# Altium project AltInterface.PrjPcb
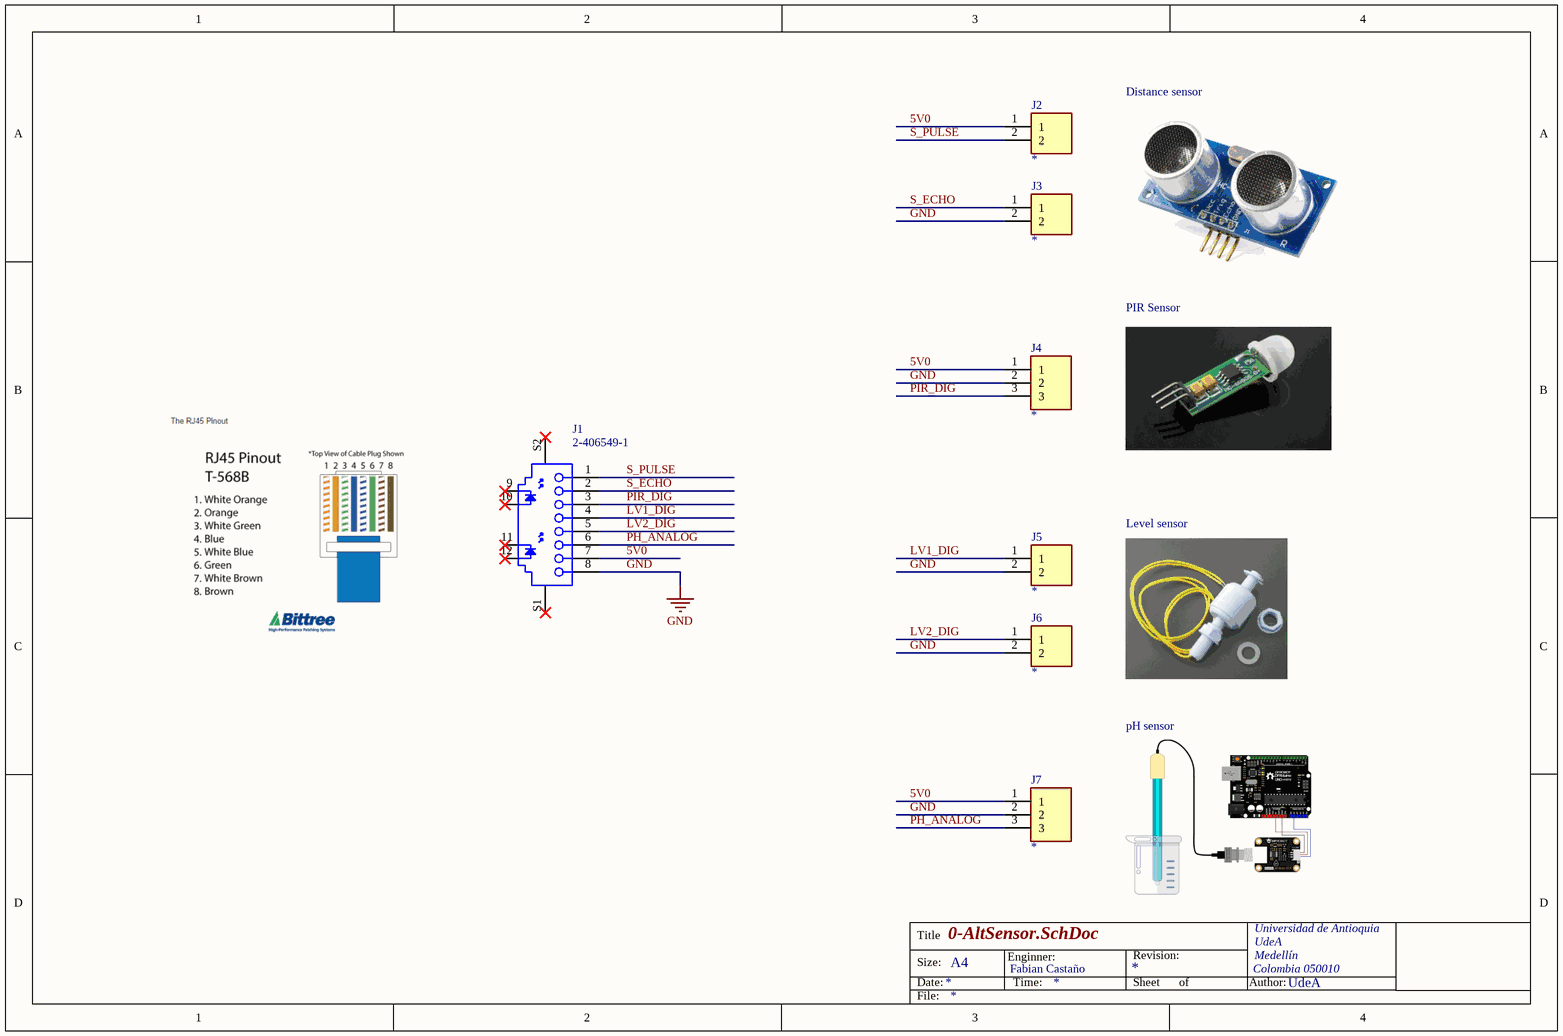
[diagram p0: 0-AltSensor.SchDoc]
1 sheet, 7 parts. Net scope: global (net labels, ports and power ports of the same name join across sheets).
Board file: AltPCB.PcbDoc

## Sheet 0-AltSensor.SchDoc
size A4; Author: Fabian Castaño; CompanyName: UdeA; Engineer: Fabian Castaño; Organization: Universidad de Antioquia; Address1: UdeA; Address2: Medellín; Address3: Antioquia; Address4: Colombia 050010

### Parts
J1  2-406549-1  [TECO-2-406549-1_V]
J2  282841-2  [TE_282841-2]  (value not drawn)
J3  282841-2  [TE_282841-2]  (value not drawn)
J4  282841-3  [TE_282841-3]  (value not drawn)
J5  282841-2  [TE_282841-2]  (value not drawn)
J6  282841-2  [TE_282841-2]  (value not drawn)
J7  282841-3  [TE_282841-3]  (value not drawn)

### Nets
GND: J1.8 J3.2 J4.2 J5.2 J6.2 J7.2
5V0: J1.7 J2.1 J4.1 J7.1
LV1_DIG: J1.4 J5.1
LV2_DIG: J1.5 J6.1
PH_ANALOG: J1.6 J7.3
PIR_DIG: J1.3 J4.3
S_ECHO: J1.2 J3.1
S_PULSE: J1.1 J2.2

Not connected (* = marked no-connect by the designer): J1 9* 10* 11* 12* S1* S2*

### Notes on the sheet
- Distance sensor
- PIR Sensor
- Level sensor
- pH sensor
- Title
- Size:
- Date:
- A4
- Enginner:
- Time:
- Revision:
- Sheet
- of
- Author:
- File:

### Library data of the parts
J1 = CMP-2000-05541-1: RJ45 Connector, Pitch 1.016 mm, 8 Position, Height 14.22 mm, Tail Length 3.18 mm, RoHS, Tray; Manufacturer: TE Connectivity; Number of Ports: 1; Tab Direction: Up; Ratings: Cat5; Catalog Drawings: JackSideEntryInverted / JackSideEntryInvertedSide; Number of Positions/Contacts: 8p8c(RJ45,Ethernet); 3D Model: 2-406549-1.pdf; Other Names: 2-406549-1-ND / A97715; Shielding: Shielded,EMIFinger; LED Color: Yellow-Green; Dynamic Catalog: ModularJacks; Connector Type: Jack; Termination: Solder; Mounting Type: ThroughHole; Datasheet URL: http://www.te.com/commerce/DocumentDelivery/DDEController?Action=showdoc&DocId=Customer+Drawing%7F406549%7FT%7Fpdf%7FEnglish%7FENG_CD_406549_T.pdf%7F2-406549-1; Mounting Technology: ThroughHole; Package Reference: 2-406549-1; RoHS Information: 2-406549-1StatementofCompliance; Housing Material: Thermoplastic; Standard Package: 63; Number of Rows: 1; Category: Connectors,Interconnects; Contact Material: PhosphorBronze; Contact Finish Thickness: 50µin(1.27µm); Family: ModularConnectors-Jacks; Packaging: Tray; Datasheet Version: Rev. T, 11/2014; Operating Temperature: -40°C~85°C; Orientation: 90°Angle(Right); Contact Finish: Gold; Features: BoardGuide; Package Description: RJ45 Connector, Pitch 1.016 mm, 8 Position, Height 14.22 mm, Tail Length 3.18 mm; Manufacturer URL: http://www.te.com/
J2 J3 J5 J6 = 282841-2: Conn Terminal Block 2 POS 5.08mm Solder ST Thru-Hole 17.5A/Contact; MF: TE Connectivity; SnapEDA_Link: https://www.snapeda.com/parts/282841-2/TE%20Connectivity%20AMP%20Connectors/view-part/434231/?ref=snap; Availability: Unavailable; TE_purchase_URL: https://www.te.com/usa-en/product-282841-2.html?te_bu=Cor&te_type=disp&te_campaign=seda_glo_cor-seda-global-disp-prtnr-fy19-seda-model-bom-cta_sma-317_1&elqCampaignId=32493; Value: *; EU_RoHS_Compliance: Compliant with Exemptions; Price: None; MP: 282841-2; Package: None; Comment_1: *
J4 J7 = 282841-3: Conn Terminal Block 3 POS 5.08mm Solder ST Thru-Hole 17.5A/Contact; MF: TE Connectivity; MP: 282841-2; SnapEDA_Link: https://www.snapeda.com/parts/282841-2/TE%20Connectivity%20AMP%20Connectors/view-part/434231/?ref=snap; Availability: Unavailable; TE_purchase_URL: https://www.te.com/usa-en/product-282841-2.html?te_bu=Cor&te_type=disp&te_campaign=seda_glo_cor-seda-global-disp-prtnr-fy19-seda-model-bom-cta_sma-317_1&elqCampaignId=32493; Value: *; EU_RoHS_Compliance: Compliant with Exemptions; Price: None; Package: None; Comment_1: *